# Altium project RP2350 Board V1.PrjPcb
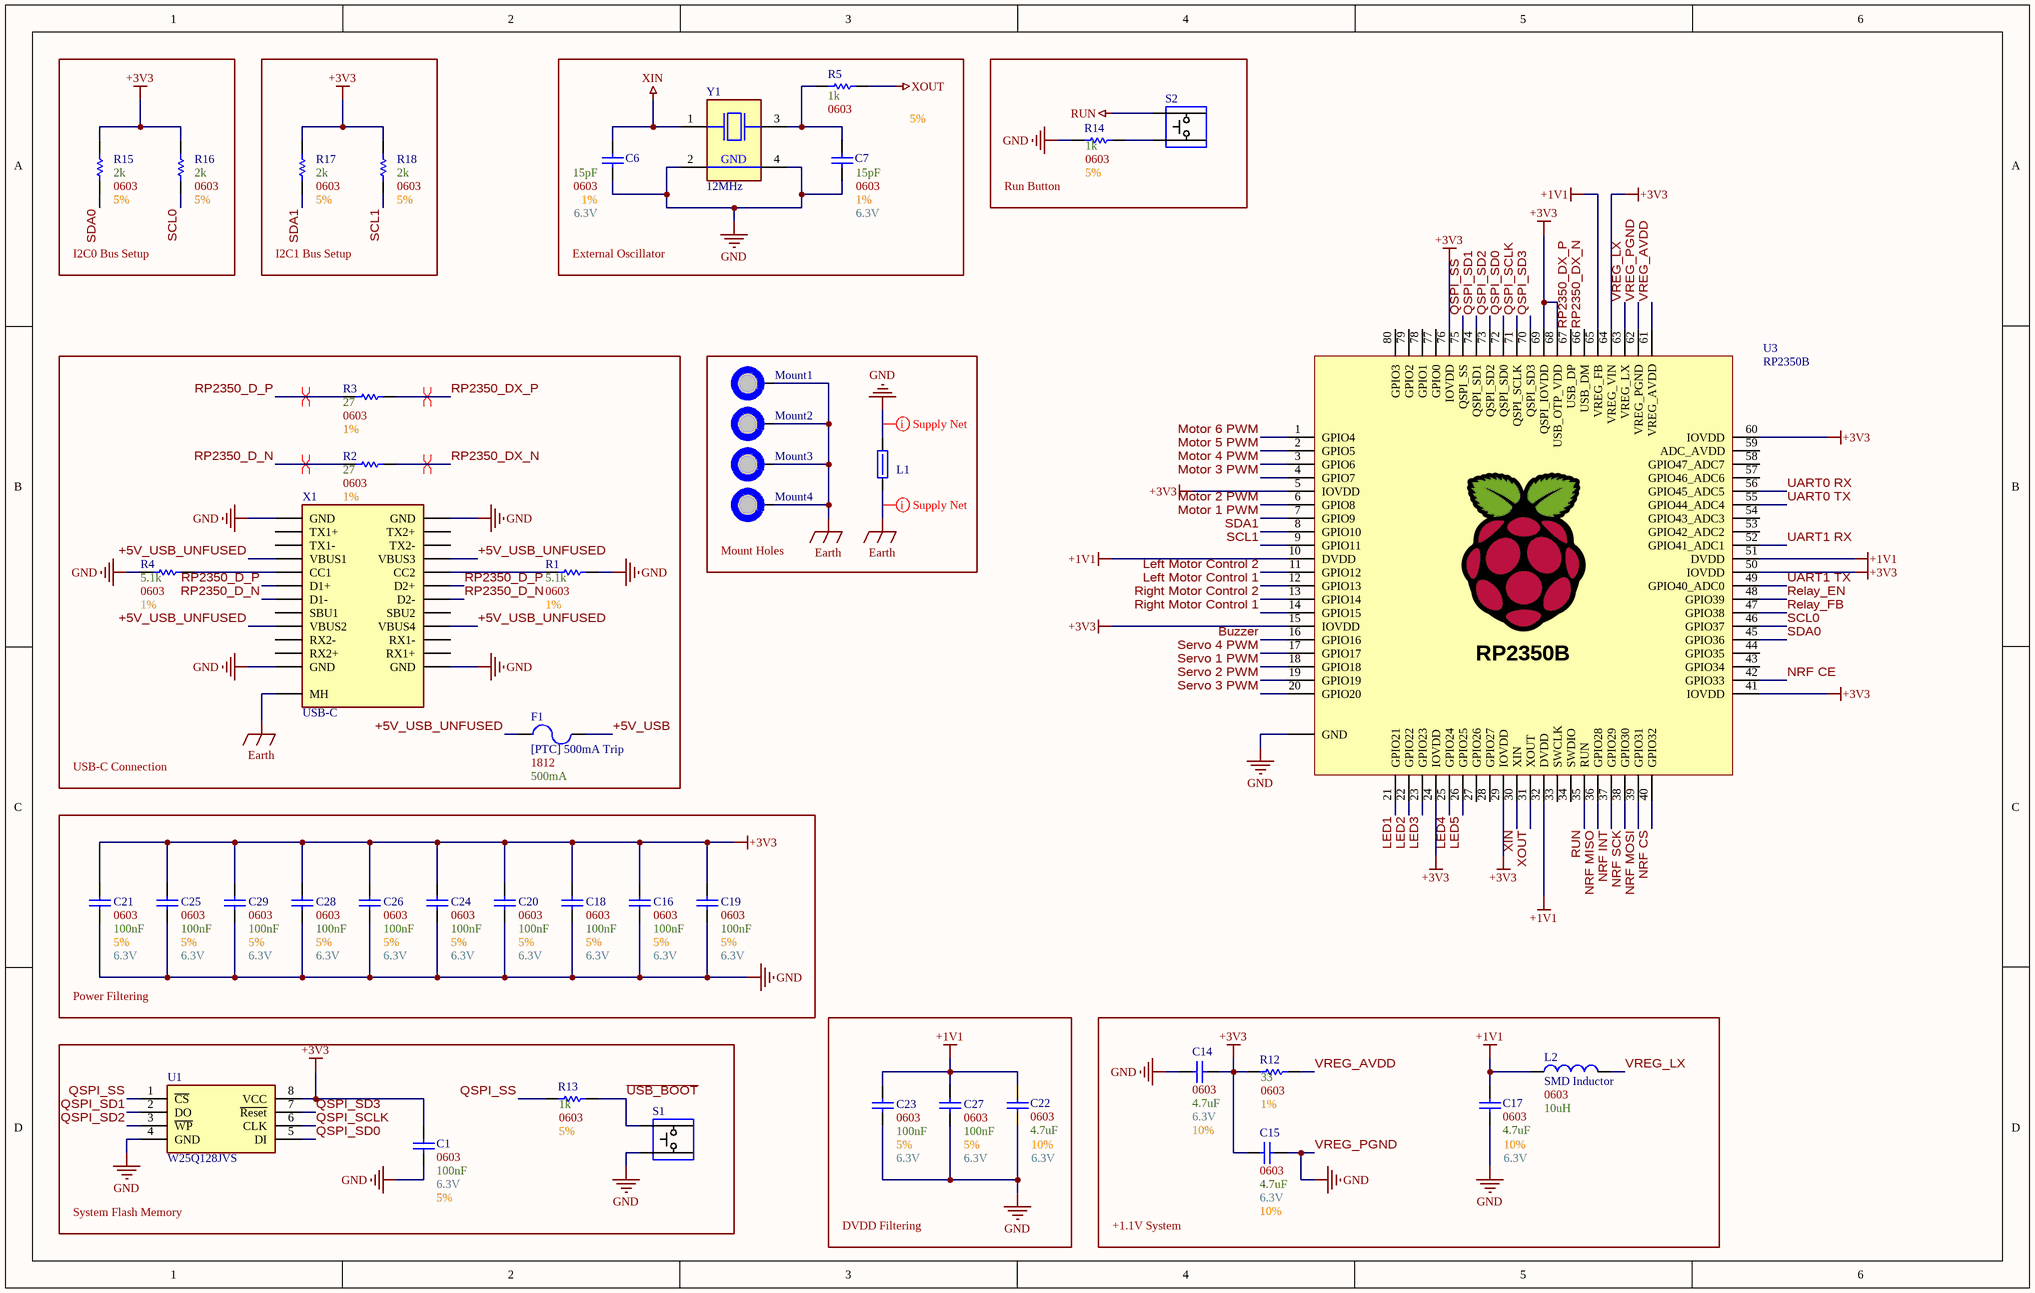
[diagram p0: RP2350.SchDoc]
3 sheets, 68 parts. Net scope: global (net labels, ports and power ports of the same name join across sheets).
Board file: Main.PcbDoc
Sheets:
  RP2350.SchDoc
  Power.SchDoc
  Motors and Steering.SchDoc

## Sheet RP2350.SchDoc
size B; SheetNumber: 4; SheetTotal: 4

### Parts
C1  Size Package: 0603  Capacitance: 100nF  Voltage: 6.3V  Tolerance: 5%  [[Cap] SMD 0603]  (hidden comment: [Cap] SMD Nonpolarized)
C6  Size Package: 0603  Capacitance: 15pF  Voltage: 6.3V  Tolerance: 1%  [[Cap] SMD 0603]  (hidden comment: [Cap] SMD Nonpolarized)
C7  Size Package: 0603  Capacitance: 15pF  Voltage: 6.3V  Tolerance: 1%  [[Cap] SMD 0603]  (hidden comment: [Cap] SMD Nonpolarized)
C14  Size Package: 0603  Capacitance: 4.7uF  Voltage: 6.3V  Tolerance: 10%  [[Cap] SMD 0603]  (hidden comment: [Cap] SMD Nonpolarized)
C15  Size Package: 0603  Capacitance: 4.7uF  Voltage: 6.3V  Tolerance: 10%  [[Cap] SMD 0603]  (hidden comment: [Cap] SMD Nonpolarized)
C16  Size Package: 0603  Capacitance: 100nF  Voltage: 6.3V  Tolerance: 5%  [[Cap] SMD 0603]  (hidden comment: [Cap] SMD Nonpolarized)
C17  Size Package: 0603  Capacitance: 4.7uF  Voltage: 6.3V  Tolerance: 10%  [[Cap] SMD 0603]  (hidden comment: [Cap] SMD Nonpolarized)
C18  Size Package: 0603  Capacitance: 100nF  Voltage: 6.3V  Tolerance: 5%  [[Cap] SMD 0603]  (hidden comment: [Cap] SMD Nonpolarized)
C19  Size Package: 0603  Capacitance: 100nF  Voltage: 6.3V  Tolerance: 5%  [[Cap] SMD 0603]  (hidden comment: [Cap] SMD Nonpolarized)
C20  Size Package: 0603  Capacitance: 100nF  Voltage: 6.3V  Tolerance: 5%  [[Cap] SMD 0603]  (hidden comment: [Cap] SMD Nonpolarized)
C21  Size Package: 0603  Capacitance: 100nF  Voltage: 6.3V  Tolerance: 5%  [[Cap] SMD 0603]  (hidden comment: [Cap] SMD Nonpolarized)
C22  Size Package: 0603  Capacitance: 4.7uF  Voltage: 6.3V  Tolerance: 10%  [[Cap] SMD 0603]  (hidden comment: [Cap] SMD Nonpolarized)
C23  Size Package: 0603  Capacitance: 100nF  Voltage: 6.3V  Tolerance: 5%  [[Cap] SMD 0603]  (hidden comment: [Cap] SMD Nonpolarized)
C24  Size Package: 0603  Capacitance: 100nF  Voltage: 6.3V  Tolerance: 5%  [[Cap] SMD 0603]  (hidden comment: [Cap] SMD Nonpolarized)
C25  Size Package: 0603  Capacitance: 100nF  Voltage: 6.3V  Tolerance: 5%  [[Cap] SMD 0603]  (hidden comment: [Cap] SMD Nonpolarized)
C26  Size Package: 0603  Capacitance: 100nF  Voltage: 6.3V  Tolerance: 5%  [[Cap] SMD 0603]  (hidden comment: [Cap] SMD Nonpolarized)
C27  Size Package: 0603  Capacitance: 100nF  Voltage: 6.3V  Tolerance: 5%  [[Cap] SMD 0603]  (hidden comment: [Cap] SMD Nonpolarized)
C28  Size Package: 0603  Capacitance: 100nF  Voltage: 6.3V  Tolerance: 5%  [[Cap] SMD 0603]  (hidden comment: [Cap] SMD Nonpolarized)
C29  Size Package: 0603  Capacitance: 100nF  Voltage: 6.3V  Tolerance: 5%  [[Cap] SMD 0603]  (hidden comment: [Cap] SMD Nonpolarized)
F1  [PTC] 500mA Trip  Size Package: 1812  Trip Current: 500mA  [[PTC] 500mA Trip]
L1  652-MH2029-300Y  [[Ferrite] SMD Bead 0805 (1)]  (value not drawn)
L2  SMD Inductor  Size Package: 0603  Inductance: 10uH  [[Inductor] SMD 0603]
Mount1  M3 Mount Hole  [[Mount] M3 Mount Hole]  (value not drawn)  (no BOM)
Mount2  M3 Mount Hole  [[Mount] M3 Mount Hole]  (value not drawn)  (no BOM)
Mount3  M3 Mount Hole  [[Mount] M3 Mount Hole]  (value not drawn)  (no BOM)
Mount4  M3 Mount Hole  [[Mount] M3 Mount Hole]  (value not drawn)  (no BOM)
R1  Tolerance: 1%  Resistance: 5.1k  Size Package: 0603  [[Res] SMD 0603]  (hidden comment: [Res] SMD Resistor)
R2  Tolerance: 1%  Resistance: 27  Size Package: 0603  [[Res] SMD 0603]  (hidden comment: [Res] SMD Resistor)
R3  Tolerance: 1%  Resistance: 27  Size Package: 0603  [[Res] SMD 0603]  (hidden comment: [Res] SMD Resistor)
R4  Tolerance: 1%  Resistance: 5.1k  Size Package: 0603  [[Res] SMD 0603]  (hidden comment: [Res] SMD Resistor)
R5  Resistance: 1k  Size Package: 0603  Tolerance: 5%  [[Res] SMD 0603]  (hidden comment: [Res] SMD Resistor)
R12  Resistance: 33  Size Package: 0603  Tolerance: 1%  [[Res] SMD 0603]  (hidden comment: [Res] SMD Resistor)
R13  Resistance: 1k  Size Package: 0603  Tolerance: 5%  [[Res] SMD 0603]  (hidden comment: [Res] SMD Resistor)
R14  Resistance: 1k  Size Package: 0603  Tolerance: 5%  [[Res] SMD 0603]  (hidden comment: [Res] SMD Resistor)
R15  Resistance: 2k  Size Package: 0603  Tolerance: 5%  [[Res] SMD 0603]  (hidden comment: [Res] SMD Resistor)
R16  Resistance: 2k  Size Package: 0603  Tolerance: 5%  [[Res] SMD 0603]  (hidden comment: [Res] SMD Resistor)
R17  Resistance: 2k  Size Package: 0603  Tolerance: 5%  [[Res] SMD 0603]  (hidden comment: [Res] SMD Resistor)
R18  Resistance: 2k  Size Package: 0603  Tolerance: 5%  [[Res] SMD 0603]  (hidden comment: [Res] SMD Resistor)
S1  Standard pushbutton  [[Switch] Pushbutton]  (value not drawn)
S2  Standard pushbutton  [[Switch] Pushbutton]  (value not drawn)
U1  W25Q128JVS  [[Mem] 16Mb Flash Memory]
U3  RP2350B  [[MCU] RP2350B]
X1  USB-C  [[Port] USB-C]
Y1  12MHz  [[XTAL] SMD 12MHz]

### Blocks framed on the sheet
I2C0 Bus Setup: R15 R16
I2C1 Bus Setup: R17 R18
External Oscillator: C6 C7 R5 Y1
Run Button: R14 S2
USB-C Connection: F1 R1-R4 X1
Mount Holes: L1 Mount1-Mount4
Power Filtering: C16 C18-C21 C24-C26 C28 C29
DVDD Filtering: C22 C23 C27
+1.1V System: C14 C15 C17 L2 R12
System Flash Memory: C1 R13 S1 U1

### Nets
+1V1: C17.2 C22.2 C23.2 C27.2 L2.1 U3.10(DVDD) U3.32(DVDD) U3.51(DVDD) U3.65(VREG_FB)
+3V3: C1.1 C14.1 C15.2 C16.2 C18.2 C19.2 C20.2 C21.2 C24.2 C25.2 C26.2 C28.2 C29.2 R12.2 R15.2 R16.2 R17.2 R18.2 U1.8(VCC) U3.5(IOVDD) U3.15(IOVDD) U3.24(IOVDD) U3.29(IOVDD) U3.41(IOVDD) U3.50(IOVDD) U3.60(IOVDD) U3.64(VREG_VIN) U3.68(USB_OTP_VDD) U3.69(QSPI_IOVDD) U3.76(IOVDD)
Earth: L1.1 Mount1.1 Mount2.1 Mount3.1 Mount4.1 X1.MH
GND: C1.2 C6.1 C7.1 C14.2 C15.1 C16.1 C17.1 C18.1 C19.1 C20.1 C21.1 C22.1 C23.1 C24.1 C25.1 C26.1 C27.1 C28.1 C29.1 L1.2 R1.2 R4.1 R14.2 S1.2 U1.4(GND) U3.62(VREG_PGND) U3.Pad(GND) X1.A1(GND) X1.A12(GND) X1.B1(GND) X1.B12(GND) Y1.2(GND) Y1.4(GND)  [also labelled VREG_PGND]
RUN: S2.1 U3.35(RUN)
XIN: C6.2 U3.30(XIN) Y1.1(XTAL1)
XOUT: R5.1 U3.31(XOUT)
+5V_USB: F1.2
+5V_USB_UNFUSED: F1.1 X1.A4(VBUS1) X1.A9(VBUS2) X1.B4(VBUS3) X1.B9(VBUS4)
Buzzer: U3.16(GPIO16)
LED1: U3.21(GPIO21)
LED2: U3.22(GPIO22)
LED3: U3.23(GPIO23)
LED4: U3.25(GPIO24)
LED5: U3.26(GPIO25)
Left Motor Control 1: U3.12(GPIO13)
Left Motor Control 2: U3.11(GPIO12)
Motor 1 PWM: U3.7(GPIO9)
Motor 2 PWM: U3.6(GPIO8)
Motor 3 PWM: U3.4(GPIO7)
Motor 4 PWM: U3.3(GPIO6)
Motor 5 PWM: U3.2(GPIO5)
Motor 6 PWM: U3.1(GPIO4)
NRF CE: U3.42(GPIO33)
NRF CS: U3.40(GPIO32)
NRF INT: U3.37(GPIO29)
NRF MISO: U3.36(GPIO28)
NRF MOSI: U3.39(GPIO31)
NRF SCK: U3.38(GPIO30)
QSPI_SCLK: U1.6(CLK) U3.71(QSPI_SCLK)
QSPI_SD0: U1.5(DI) U3.72(QSPI_SD0)
QSPI_SD1: U1.2(DO) U3.74(QSPI_SD1)
QSPI_SD2: U1.3(~{WP}) U3.73(QSPI_SD2)
QSPI_SD3: U1.7(~{Reset}) U3.70(QSPI_SD3)
QSPI_SS: R13.2 U1.1(~{CS}) U3.75(QSPI_SS)
Relay_EN: U3.48(GPIO39)
Relay_FB: U3.47(GPIO38)
Right Motor Control 1: U3.14(GPIO15)
Right Motor Control 2: U3.13(GPIO14)
RP2350_D_N: R2.1 X1.A7(D1-) X1.B7(D2-)
RP2350_D_P: R3.1 X1.A6(D1+) X1.B6(D2+)
RP2350_DX_N: R2.2 U3.66(USB_DM)
RP2350_DX_P: R3.2 U3.67(USB_DP)
SCL0: R16.1 U3.46(GPIO37)
SCL1: R18.1 U3.9(GPIO11)
SDA0: R15.1 U3.45(GPIO36)
SDA1: R17.1 U3.8(GPIO10)
Servo 1 PWM: U3.18(GPIO18)
Servo 2 PWM: U3.19(GPIO19)
Servo 3 PWM: U3.20(GPIO20)
Servo 4 PWM: U3.17(GPIO17)
~{USB_BOOT}: R13.1 S1.1
UART0 RX: U3.56(GPIO45_ADC5)
UART0 TX: U3.55(GPIO44_ADC4)
UART1 RX: U3.52(GPIO41_ADC1)
UART1 TX: U3.49(GPIO40_ADC0)
VREG_AVDD: R12.1 U3.61(VREG_AVDD)
VREG_LX: L2.2 U3.63(VREG_LX)
NetC7_2: C7.2 R5.2 Y1.3(XTAL2)
NetR1_1: R1.1 X1.B5(CC2)
NetR4_2: R4.2 X1.A5(CC1)
NetR14_1: R14.1 S2.2

Not connected (* = marked no-connect by the designer): U3 27(GPIO26) 28(GPIO27) 33(SWCLK) 34(SWDIO) 43(GPIO34) 44(GPIO35) 53(GPIO42_ADC2) 54(GPIO43_ADC3) 57(GPIO46_ADC6) 58(GPIO47_ADC7) 59(ADC_AVDD) 77(GPIO0) 78(GPIO1) 79(GPIO2) 80(GPIO3); X1 A2(TX1+) A3(TX1-) A8(SBU1) A10(RX2-) A11(RX2+) B2(TX2+) B3(TX2-) B8(SBU2) B10(RX1-) B11(RX1+)

### Layout directives
differential pair; differential pair class USB_Pairs: RP2350_D_N, RP2350_D_P, RP2350_DX_N, RP2350_DX_P
net class Supply_Nets: Earth, GND

### Library data of the parts
F1 = [PTC] 500mA Trip: MF-MSMF050-2; Supplier 1: DigiKey; Supplier Part Number 1: MF-MSMF050-2DKR-ND
L1 = [Ferrite] SMD Ferrite Bead (1): Res @ Freq: 30 @ 100MHz; Size Package: 0805; Supplier 1: DigiKey; Supplier Part Number 1: MH2029-300YCT-ND
L2 = [Inductor] SMD Inductor: JLC Part #: *; Mouser Part #: *; Supplier 1: DigiKey; Supplier Part Number 1: 553-BSCY00160808100MCPCT-ND
Mount1-Mount4 = [Mount] M3 Mount Hole: Place at least 4.5mm from board edge. Plated.
R1-R5 R12-R18 = [Res] SMD Resistor: Generic; Supplier 1: DigiKey
  R1 R4: Supplier Part Number 1: 311-5.10KHRDKR-ND
  R2 R3: Supplier Part Number 1: 749-1631-1-ND
  R5 R13 R14: Supplier Part Number 1: RMCF0603FT1K00DKR-ND
  R12: Supplier Part Number 1: RR08Q33DCT-ND
  R15-R18: Supplier Part Number 1: P2.0KBDCT-ND
S1 S2 = [Switch] Pushbutton: Supplier 1: DigiKey; Supplier Part Number 1: 450-1650-ND
U1 = [Mem] 16Mb Flash Memory: W25Q128JVSIQ TR; Supplier 1: DigiKey; Supplier Part Number 1: 256-W25Q128JVSIQTRCT-ND
U3 = [MCU] RP2350B: QFN-80 Package; Supplier 1: DigiKey; Supplier Part Number 1: 2648-SC1510-A4CT-ND
X1 = [Port] USB Type-C: Supplier 1: DigiKey; Supplier Part Number 1: 670-3104-1-ND
Y1 = [XTAL] SMD 12MHz: 815-ABM8-272-T3; Supplier 1: DigiKey; Supplier Part Number 1: 535-ABM8-272-T3CT-ND
C1 C6 C7 C14-C29 = [Cap] SMD Nonpolarized: Supplier 1: DigiKey
  C1 C16 C18-C21 C23-C29: Supplier Part Number 1: 311-1088-6-ND
  C6 C7: Supplier Part Number 1: 490-16416-1-ND
  C14 C15 C17 C22: Supplier Part Number 1: 490-7203-1-ND

## Sheet Power.SchDoc
size A; SheetNumber: 3; SheetTotal: 4
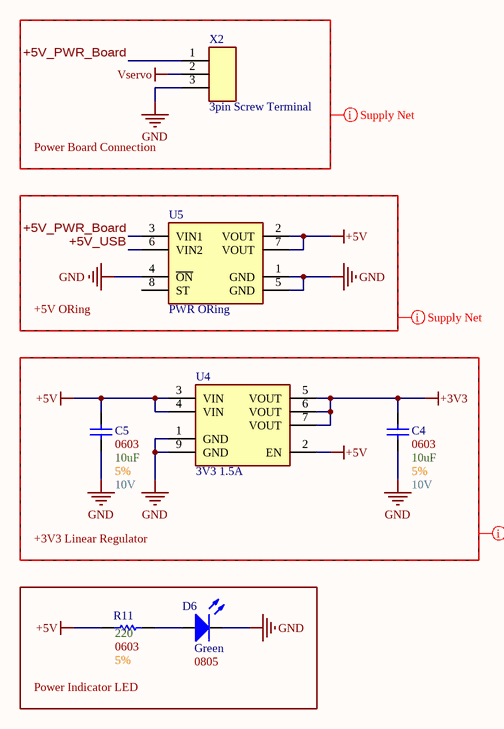
[diagram p1: Power.SchDoc]

### Parts
C4  Size Package: 0603  Capacitance: 10uF  Voltage: 10V  Tolerance: 5%  [[Cap] SMD 0603]  (hidden comment: [Cap] SMD Nonpolarized)
C5  Size Package: 0603  Capacitance: 10uF  Voltage: 10V  Tolerance: 5%  [[Cap] SMD 0603]  (hidden comment: [Cap] SMD Nonpolarized)
D6  Color: Green  Size Package: 0805  [[LED] SMD 0805]  (hidden comment: SMD LED)
R11  Resistance: 220  Size Package: 0603  Tolerance: 5%  [[Res] SMD 0603]  (hidden comment: [Res] SMD Resistor)
U4  3V3 1.5A  [[Reg Lin] 3V3 Regulator 1.5A]
U5  PWR ORing  [[IC] Power ORing Controller]
X2  3pin Screw Terminal  [[Screw Terminal] 3pin 5mm]

### Blocks framed on the sheet
Power Board Connection: X2
+5V ORing: U5
+3V3 Linear Regulator: C4 C5 U4
Power Indicator LED: D6 R11

### Nets
+3V3: C4.2 U4.5(VOUT) U4.6(VOUT) U4.7(VOUT)
+5V: C5.2 R11.2 U4.2(EN) U4.3(VIN) U4.4(VIN) U5.2(VOUT) U5.7(VOUT)
GND: C4.1 C5.1 D6.2(Cathode) U4.1(GND) U4.9(GND) U5.1(GND) U5.4(~{ON}) U5.5(GND) X2.3
Vservo: X2.2
+5V_PWR_Board: U5.3(VIN1) X2.1
+5V_USB: U5.6(VIN2)
NetD6_1: D6.1(Anode) R11.1

Not connected (* = marked no-connect by the designer): U5 8(ST)

### Layout directives
net class Supply_Nets: +3V3, +5V, +5V_PWR_Board, +5V_USB, GND, Vservo

### Library data of the parts
D6 = [LED] SMD: Generic; Part #: *; Supplier 1: DigiKey; Supplier Part Number 1: 475-LGR971-KN-1DKR-ND
R11 = [Res] SMD Resistor: Generic; Supplier 1: DigiKey; Supplier Part Number 1: A129741CT-ND
U4 = [Reg Lin] 3V3 Regulator 1.5A: AP7362A-33SP-13; Supplier 1: DigiKey; Supplier Part Number 1: AP7362A-33SP-13DICT-ND
U5 = [IC] Power ORing Controller: Supplier 1: DigiKey; Supplier Part Number 1: 296-LM66200DRLRCT-ND
X2 = [Screw Terminal] 3pin: Supplier 1: DigiKey; Supplier Part Number 1: 102-6162-ND
C4 C5 = [Cap] SMD Nonpolarized: Supplier 1: DigiKey; Supplier Part Number 1: 1276-1192-1-ND

## Sheet Motors and Steering.SchDoc
size A; SheetNumber: 4; SheetTotal: 4
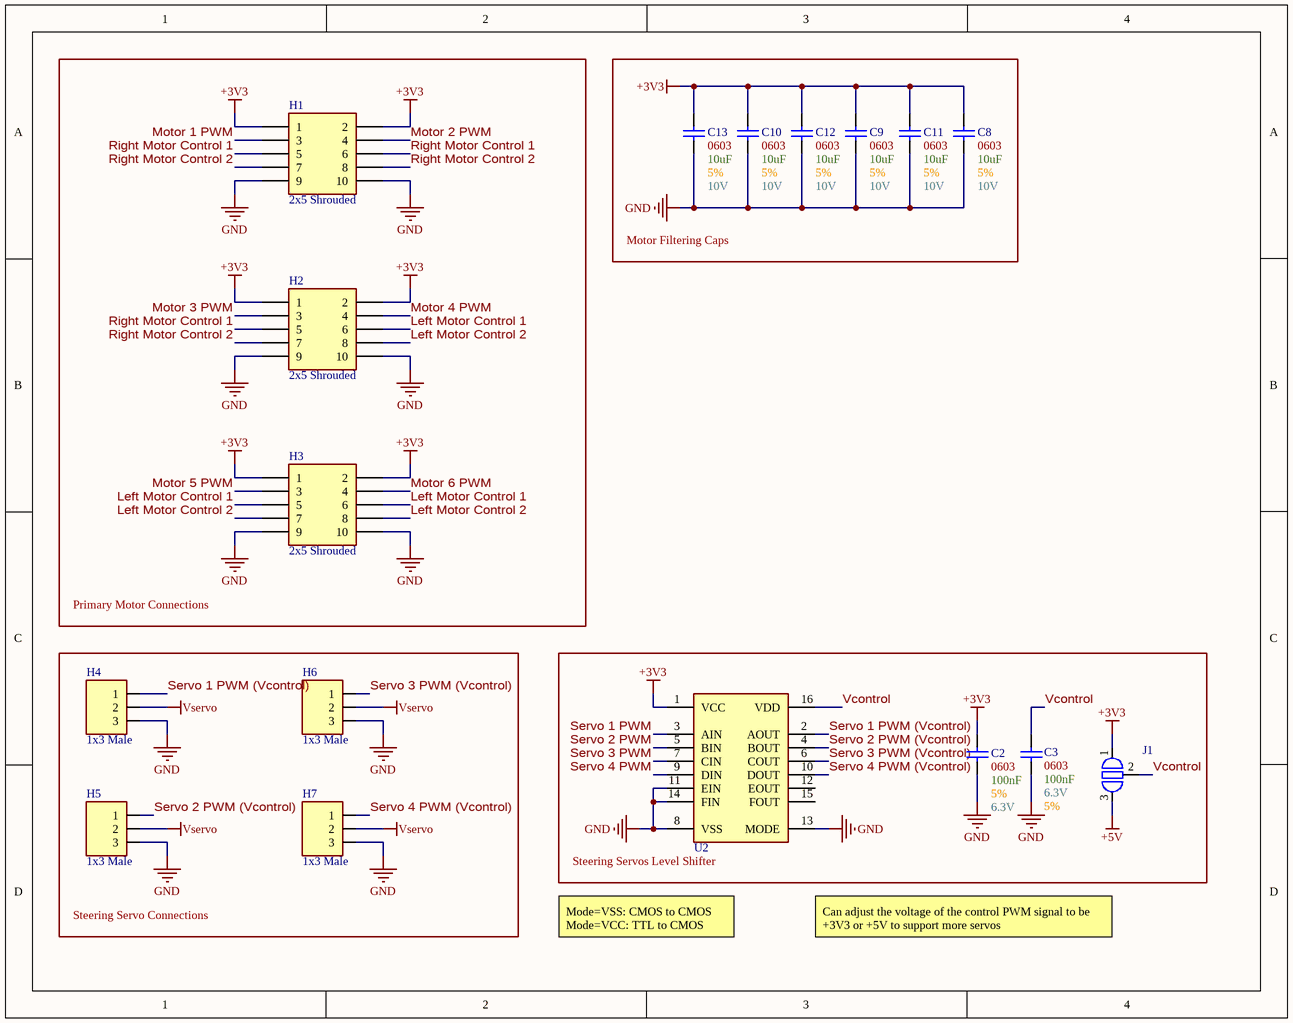
[diagram p2: Motors and Steering.SchDoc]

### Parts
C2  Size Package: 0603  Capacitance: 100nF  Voltage: 6.3V  Tolerance: 5%  [[Cap] SMD 0603]  (hidden comment: [Cap] SMD Nonpolarized)
C3  Size Package: 0603  Capacitance: 100nF  Voltage: 6.3V  Tolerance: 5%  [[Cap] SMD 0603]  (hidden comment: [Cap] SMD Nonpolarized)
C8  Size Package: 0603  Capacitance: 10uF  Voltage: 10V  Tolerance: 5%  [[Cap] SMD 0603]  (hidden comment: [Cap] SMD Nonpolarized)
C9  Size Package: 0603  Capacitance: 10uF  Voltage: 10V  Tolerance: 5%  [[Cap] SMD 0603]  (hidden comment: [Cap] SMD Nonpolarized)
C10  Size Package: 0603  Capacitance: 10uF  Voltage: 10V  Tolerance: 5%  [[Cap] SMD 0603]  (hidden comment: [Cap] SMD Nonpolarized)
C11  Size Package: 0603  Capacitance: 10uF  Voltage: 10V  Tolerance: 5%  [[Cap] SMD 0603]  (hidden comment: [Cap] SMD Nonpolarized)
C12  Size Package: 0603  Capacitance: 10uF  Voltage: 10V  Tolerance: 5%  [[Cap] SMD 0603]  (hidden comment: [Cap] SMD Nonpolarized)
C13  Size Package: 0603  Capacitance: 10uF  Voltage: 10V  Tolerance: 5%  [[Cap] SMD 0603]  (hidden comment: [Cap] SMD Nonpolarized)
H1  2x5 Shrouded  [[Header] Shrouded 2x5 Male]
H2  2x5 Shrouded  [[Header] Shrouded 2x5 Male]
H3  2x5 Shrouded  [[Header] Shrouded 2x5 Male]
H4  1x3 Male  [[Header] Shrouded 1x3 Male]
H5  1x3 Male  [[Header] Shrouded 1x3 Male]
H6  1x3 Male  [[Header] Shrouded 1x3 Male]
H7  1x3 Male  [[Header] Shrouded 1x3 Male]
J1  Thru-Hole Jumper  [[Jumper] Thru-Hole 3pin]  (value not drawn)
U2  [IC] Level Shifter Unidirectional 3-18V  [[IC] Level Shifter Unidirectional 3-18V]  (value not drawn)

### Blocks framed on the sheet
Primary Motor Connections: H1-H3
Motor Filtering Caps: C8-C13
Steering Servo Connections: H4-H7
Steering Servos Level Shifter: C2 C3 J1 U2

### Nets
+3V3: C2.2 C8.2 C9.2 C10.2 C11.2 C12.2 C13.2 H1.1 H1.2 H2.1 H2.2 H3.1 H3.2 J1.1 U2.1(VCC)
+5V: J1.3
GND: C2.1 C3.2 C8.1 C9.1 C10.1 C11.1 C12.1 C13.1 H1.9 H1.10 H2.9 H2.10 H3.9 H3.10 H4.3 H5.3 H6.3 H7.3 U2.8(VSS) U2.11(EIN) U2.13(MODE) U2.14(FIN)
Vservo: H4.2 H5.2 H6.2 H7.2
Left Motor Control 1: H2.6 H3.5 H3.6
Left Motor Control 2: H2.8 H3.7 H3.8
Motor 1 PWM: H1.3
Motor 2 PWM: H1.4
Motor 3 PWM: H2.3
Motor 4 PWM: H2.4
Motor 5 PWM: H3.3
Motor 6 PWM: H3.4
Right Motor Control 1: H1.5 H1.6 H2.5
Right Motor Control 2: H1.7 H1.8 H2.7
Servo 1 PWM: U2.3(AIN)
Servo 1 PWM (Vcontrol): H4.1 U2.2(AOUT)
Servo 2 PWM: U2.5(BIN)
Servo 2 PWM (Vcontrol): H5.1 U2.4(BOUT)
Servo 3 PWM: U2.7(CIN)
Servo 3 PWM (Vcontrol): H6.1 U2.6(COUT)
Servo 4 PWM: U2.9(DIN)
Servo 4 PWM (Vcontrol): H7.1 U2.10(DOUT)
Vcontrol: C3.1 J1.2(Common) U2.16(VDD)

Not connected (* = marked no-connect by the designer): U2 12(EOUT) 15(FOUT)

### Notes on the sheet
- Mode=VSS: CMOS to CMOS
  Mode=VCC: TTL to CMOS
- Can adjust the voltage of the control PWM signal to be +3V3 or +5V to support more servos

### Library data of the parts
H1-H3 = [Header] Shrouded 2x5 Male: BHR-10-VUA; Supplier 1: DigiKey; Supplier Part Number 1: 2057-BHR-10-VUA-ND
H4-H7 = [Header] Shrouded 1x3 Male: 070543-0037 / Mates with 005057-9403; Supplier 1: DigiKey; Supplier 2: DigiKey; Supplier Part Number 1: WM4825-ND; Supplier Part Number 2: WM2901-ND
J1 = [Jump] Thru-Hole 3pin: Clip Jumper; NO/NC: 2,3 NC
U2 = [IC] Level Shifter Unidirectional 3-18V: MC14504BDTR2G; Supplier 1: DigiKey; Supplier Part Number 1: MC14504BDTR2GOSCT-ND
C2 C3 C8-C13 = [Cap] SMD Nonpolarized: Supplier 1: DigiKey
  C2 C3: Supplier Part Number 1: 311-1088-6-ND
  C8-C13: Supplier Part Number 1: 1276-1192-1-ND

## Nets that join several sheets
+3V3: RP2350 (30 pins), Power (C4.2 U4.5 U4.6 U4.7), Motors and Steering (15 pins)
+5V: Power (7 pins), Motors and Steering (J1.3)
GND: RP2350 (33 pins), Power (9 pins), Motors and Steering (22 pins)
Vservo: Power (X2.2), Motors and Steering (H4.2 H5.2 H6.2 H7.2)
+5V_USB: RP2350 (F1.2), Power (U5.6)
Left Motor Control 1: RP2350 (U3.12), Motors and Steering (H2.6 H3.5 H3.6)
Left Motor Control 2: RP2350 (U3.11), Motors and Steering (H2.8 H3.7 H3.8)
Motor 1 PWM: RP2350 (U3.7), Motors and Steering (H1.3)
Motor 2 PWM: RP2350 (U3.6), Motors and Steering (H1.4)
Motor 3 PWM: RP2350 (U3.4), Motors and Steering (H2.3)
Motor 4 PWM: RP2350 (U3.3), Motors and Steering (H2.4)
Motor 5 PWM: RP2350 (U3.2), Motors and Steering (H3.3)
Motor 6 PWM: RP2350 (U3.1), Motors and Steering (H3.4)
Right Motor Control 1: RP2350 (U3.14), Motors and Steering (H1.5 H1.6 H2.5)
Right Motor Control 2: RP2350 (U3.13), Motors and Steering (H1.7 H1.8 H2.7)
Servo 1 PWM: RP2350 (U3.18), Motors and Steering (U2.3)
Servo 2 PWM: RP2350 (U3.19), Motors and Steering (U2.5)
Servo 3 PWM: RP2350 (U3.20), Motors and Steering (U2.7)
Servo 4 PWM: RP2350 (U3.17), Motors and Steering (U2.9)